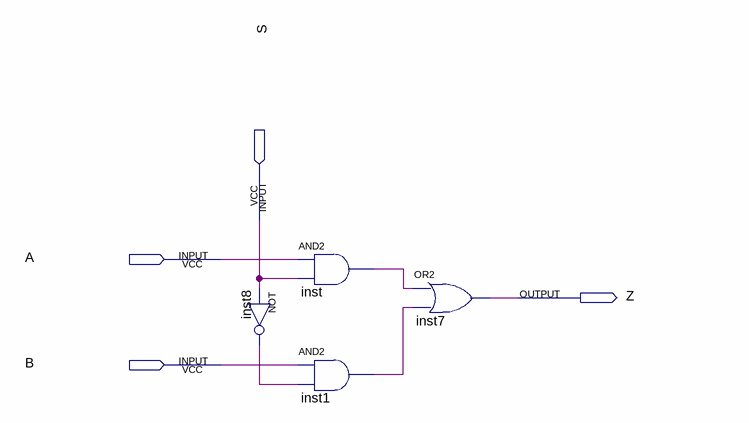
[diagram p0: schematic sheet]
// Quartus schematic Mux2x1.bdf as structural Verilog: 4 symbols, 4 pins
module Mux2x1 (
  input  S,
  input  A,
  input  B,
  output Z
);

  wire inst1_out, inst8_out, inst_out;

  not inst8 (inst8_out, S);
  and inst (inst_out, A, S);
  and inst1 (inst1_out, B, inst8_out);
  or inst7 (Z, inst_out, inst1_out);
endmodule
